# EAGLE design controller-board (EAGLE 7.3.0)
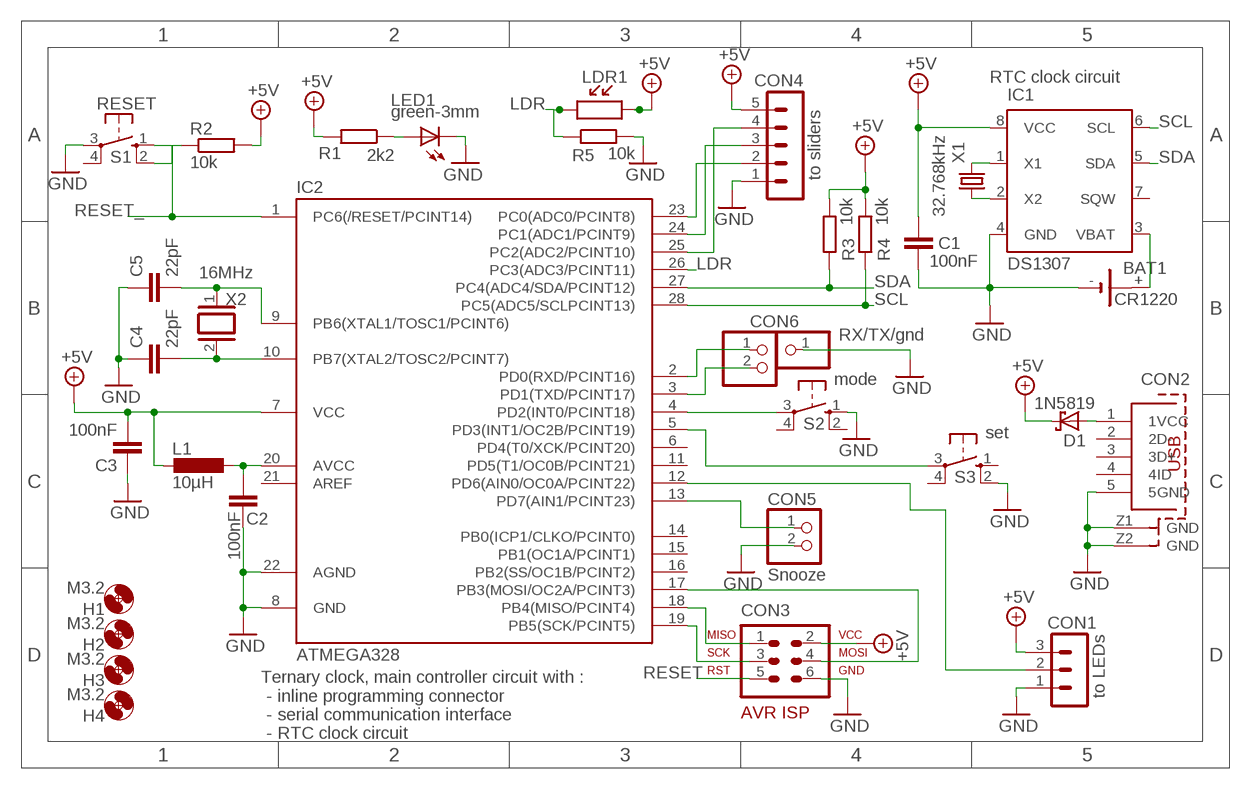
[diagram p0: schematic, sheet 1]

## Parts
BAT1  CR1220  CR1220HOLDER  [CR1220HOLDER]
C1  100nF  C-EU050-025X075  [C050-025X075]
C2  100nF  C-EU050-025X075  [C050-025X075]
C3  100nF  C-EU050-025X075  [C050-025X075]
C4  22pF  C2.5/2  [C2.5-2]
C5  22pF  C2.5/2  [C2.5-2]
CON1  to LEDs  MA03-1  [MA03-1]
CON2  614105150721  [614105150721]
CON3  AVR-ISP  AVR-ISP-6VERT  [AVR-ISP-6]
CON4  to sliders  MA05-1  [MA05-1]
CON5  Snooze  PINHD-1X2  [1X02]
CON6  RX/TX/gnd  PINHD-1X2  [1X02]
CON6B  Ser-GND  PINHD-1X1  [1X01]
D1  1N5819  1N5819-B  [DO41-7.6]
H1  M3.2  MOUNT-HOLE3.2  [3,2]
H2  M3.2  MOUNT-HOLE3.2  [3,2]
H3  M3.2  MOUNT-HOLE3.2  [3,2]
H4  M3.2  MOUNT-HOLE3.2  [3,2]
IC1  DS1307  [DIL08]
IC2  ATMEGA328  ATMEGA48/88/168-PU  [DIL28-3]
L1  10µH  L-EU0207/7  [0207/7]
LDR1  LDR  [LDR]
LED1  green-3mm  LED3MM  [LED3MM]
R1  2k2  R-EU_0207/7  [0207/7]
R2  10k  R-EU_0207/7  [0207/7]
R3  10k  R-EU_0207/7  [0207/7]
R4  10k  R-EU_0207/7  [0207/7]
R5  10k  R-EU_0207/7  [0207/7]
S1  RESET  10-XX  [B3F-10XX]
S2  mode  10-XX  [B3F-10XX]
S3  set  10-XX  [B3F-10XX]
X1  32.768kHz  CRYSTALTC38H  [TC38H]
X2  16MHz  XTAL/S  [QS]

## Nets
+5V: C1.1 C3.2 CON1.3 CON3.2 CON4.5 D1.C IC1.8(VCC) IC2.7(VCC) L1.2 LDR1.P$2 R1.2 R2.2 R3.2 R4.2
GND: BAT1.- C1.2 C2.1 C3.1 C4.1 C5.1 CON1.1 CON2.5(5GND) CON2.Z1(GND) CON2.Z2(GND) CON3.6 CON4.1 CON5.2 CON6B.1 IC1.4(GND) IC2.8(GND) IC2.22(AGND) LED1.K(C) R5.2 S1.3(P) S2.1(S) S3.2(S1)
LDR: IC2.26(PC3(ADC3/PCINT11)) LDR1.P$1 R5.1
N$2: C5.2 IC2.9(PB6(XTAL1/TOSC1/PCINT6)) X2.1
N$3: C2.2 IC2.20(AVCC) L1.1
N$4: IC2.4(PD2(INT0/PCINT18)) S2.3(P)
N$5: IC2.5(PD3(INT1/OC2B/PCINT19)) S3.3(P)
N$6: CON1.2 IC2.12(PD6(AIN0/OC0A/PCINT22))
N$7: C4.2 IC2.10(PB7(XTAL2/TOSC2/PCINT7)) X2.2
N$8: CON3.4 IC2.17(PB3(MOSI/OC2A/PCINT3))
N$9: CON3.1 IC2.18(PB4(MISO/PCINT4))
N$10: CON3.3 IC2.19(PB5(SCK/PCINT5))
N$11: CON6.2 IC2.3(PD1(TXD/PCINT17))
N$12: CON6.1 IC2.2(PD0(RXD/PCINT16))
N$16: CON4.4 IC2.25(PC2(ADC2/PCINT10))
N$17: CON4.3 IC2.24(PC1(ADC1/PCINT9))
N$19: CON4.2 IC2.23(PC0(ADC0/PCINT8))
N$20: IC1.1(X1) X1.2
N$21: IC1.2(X2) X1.1
N$22: BAT1.+ IC1.3(VBAT)
N$23: CON5.1 IC2.13(PD7(AIN1/PCINT23))
N$31: CON2.1(1VCC) D1.A
N$56: LED1.A R1.1
RESET: CON3.5 R2.1 S1.2(S1)
RESET_: IC2.1(PC6(/RESET/PCINT14)) S1.1(S)
SCL: IC1.6(SCL) IC2.28(PC5(ADC5/SCLPCINT13)) R4.1
SDA: IC1.5(SDA) IC2.27(PC4(ADC4/SDA/PCINT12)) R3.1
Unconnected: CON2.2(2D-) CON2.3(3D+) CON2.4(4ID) IC1.7(SQW) IC2.6(PD4(T0/XCK/PCINT20)) IC2.11(PD5(T1/OC0B/PCINT21)) IC2.14(PB0(ICP1/CLKO/PCINT0)) IC2.15(PB1(OC1A/PCINT1)) IC2.16(PB2(SS/OC1B/PCINT2)) IC2.21(AREF) S1.4(P1) S2.2(S1) S2.4(P1) S3.1(S) S3.4(P1)

## Notes on the sheet
- RTC clock circuit
- Ternary clock, main controller circuit with : 
   - inline programming connector
   - serial communication interface
   - RTC clock circuit

## Library data of the parts
BAT1 = base3clock:CR1220HOLDER: 3V lithium Battery Holder To be used with CR1220 batteries in horizontal position The included packages can be used for both surface and through-hole mounting (multifunctional pads)
C1 = rcl:C-EU: CAPACITOR, European symbol
C2 C3 = resistor:C-EU: CAPACITOR, European symbol
C4 C5 = capacitor-wima:C: CAPACITOR naming: grid - package width
CON1 = con-lstb:MA03-1: PIN HEADER; OC_FARNELL: unknown; OC_NEWARK: unknown
CON2 = Wurth_Elektronik_Electromechanic_Input-Output_Connectors_rev15c:614105150721: WR-COM_USB_Micro Type B_Vertical_THT; Micro Type B Vertical THT- Tape & Reel not for Pick & Place machine Code : Con_I-O_COM_USB_2.0_B_614105150721_614105150721 <http://katalog.we-online.de/media/images/eican/Con_I-O_COM_USB_2.0_B_614105150721_pf2.jpg> Details see: http://katalog.we-online.de/em/datasheet/614105150721.pdf Created 12/08/2014, Dan Xu 2014 (C) Wurth Elektronik
CON3 = avr-7:AVR-ISP-6: AVR ISP-6 Serial Programming Header
CON4 = con-lstb:MA05-1: PIN HEADER; OC_FARNELL: unknown; OC_NEWARK: unknown
CON5 CON6 = pinhead:PINHD-1X2: PIN HEADER
CON6B = pinhead:PINHD-1X1: PIN HEADER
D1 = diode:1N581*: 1.0A SCHOTTKY BARRIER RECTIFIER Source: http://www.diodes.com/datasheets/ds23001.pdf
H1-H4 = holes:MOUNT-HOLE: MOUNTING HOLE with drill center marker
IC1 = ds1307_pcf8583:DS1307: I2C-Bus CLOCK/CALENDAR
IC2 = atmega8:ATMEGA48/88/168-PU
L1 = resistor:L-EU: INDUCTOR, European symbol
LDR1 = base3clock:LDR: Generic LDR
LED1 = led:LED: LED OSRAM: - CHIPLED LG R971, LG N971, LY N971, LG Q971, LY Q971, LO R971, LY R971 LH N974, LH R974 LS Q976, LO Q976, LY Q976 LO Q996 - Hyper CHIPLED LW Q18S LB Q993, LB Q99A, LB R99A - SideLED LS A670, LO A670, LY A670, LG A670, LP A670 LB A673, LV A673, LT A673, LW A673 LH A674 LY A675 LS A676, LA A676, LO A676, LY A676, LW A676 LS A679, LY A679, LG A679 - Hyper Micro SIDELED® LS Y876, LA Y876, LO Y876, LY Y876 LT Y87S - SmartLED LW L88C, LW L88S LB L89C, LB L89S, LG L890 LS L89K, LO L89K, LY L89K LS L896, LA L896, LO L896, LY L896 - TOPLED LS T670, LO T670, LY T670, LG T670, LP T670 LSG T670, LSP T670, LSY T670, LOP T670, LYG T670 LG T671, LOG T671, LSG T671 LB T673, LV T673, LT T673, LW T673 LH T674 LS T676, LA T676, LO T676, LY T676, LB T676, LH T676, LSB T676, LW T676 LB T67C, LV T67C, LT T67C, LS T67K, LO T67K, LY T67K, LW E67C LS E67B, LA E67B, LO E67B, LY E67B, LB E67C, LV E67C, LT E67C LW T67C LS T679, LY T679, LG T679 LS T770, LO T770, LY T770, LG T770, LP T770 LB T773, LV T773, LT T773, LW T773 LH T774 LS E675, LA E675, LY E675, LS T675 LS T776, LA T776, LO T776, LY T776, LB T776 LHGB T686 LT T68C, LB T68C - Hyper Mini TOPLED® LB M676 - Mini TOPLED Santana® LG M470 LS M47K, LO M47K, LY M47K Source: http://www.osram.convergy.de LUXEON: - LUMILED® LXK2-PW12-R00, LXK2-PW12-S00, LXK2-PW14-U00, LXK2-PW14-V00 LXK2-PM12-R00, LXK2-PM12-S00, LXK2-PM14-U00 LXK2-PE12-Q00, LXK2-PE12-R00, LXK2-PE12-S00, LXK2-PE14-T00, LXK2-PE14-U00 LXK2-PB12-K00, LXK2-PB12-L00, LXK2-PB12-M00, LXK2-PB14-N00, LXK2-PB14-P00, LXK2-PB14-Q00 LXK2-PR12-L00, LXK2-PR12-M00, LXK2-PR14-Q00, LXK2-PR14-R00 LXK2-PD12-Q00, LXK2-PD12-R00, LXK2-PD12-S00 LXK2-PH12-R00, LXK2-PH12-S00 LXK2-PL12-P00, LXK2-PL12-Q00, LXK2-PL12-R00 Source: www.luxeon.com KINGBRIGHT: KA-3528ASYC Source: www.kingbright.com
R1 = rcl:R-EU_: RESISTOR, European symbol
R2-R5 = resistor:R-EU_: RESISTOR, European symbol
S1-S3 = switch-omron:10-XX: OMRON SWITCH; MPN: B3F-1000; OC_FARNELL: 176432; OC_NEWARK: 36M3542
X1 = adafruit:CRYSTAL: CRYSTAL; OC_FARNELL: unknown; OC_NEWARK: unknown
X2 = special:XTAL/S: CRYSTAL

## Board
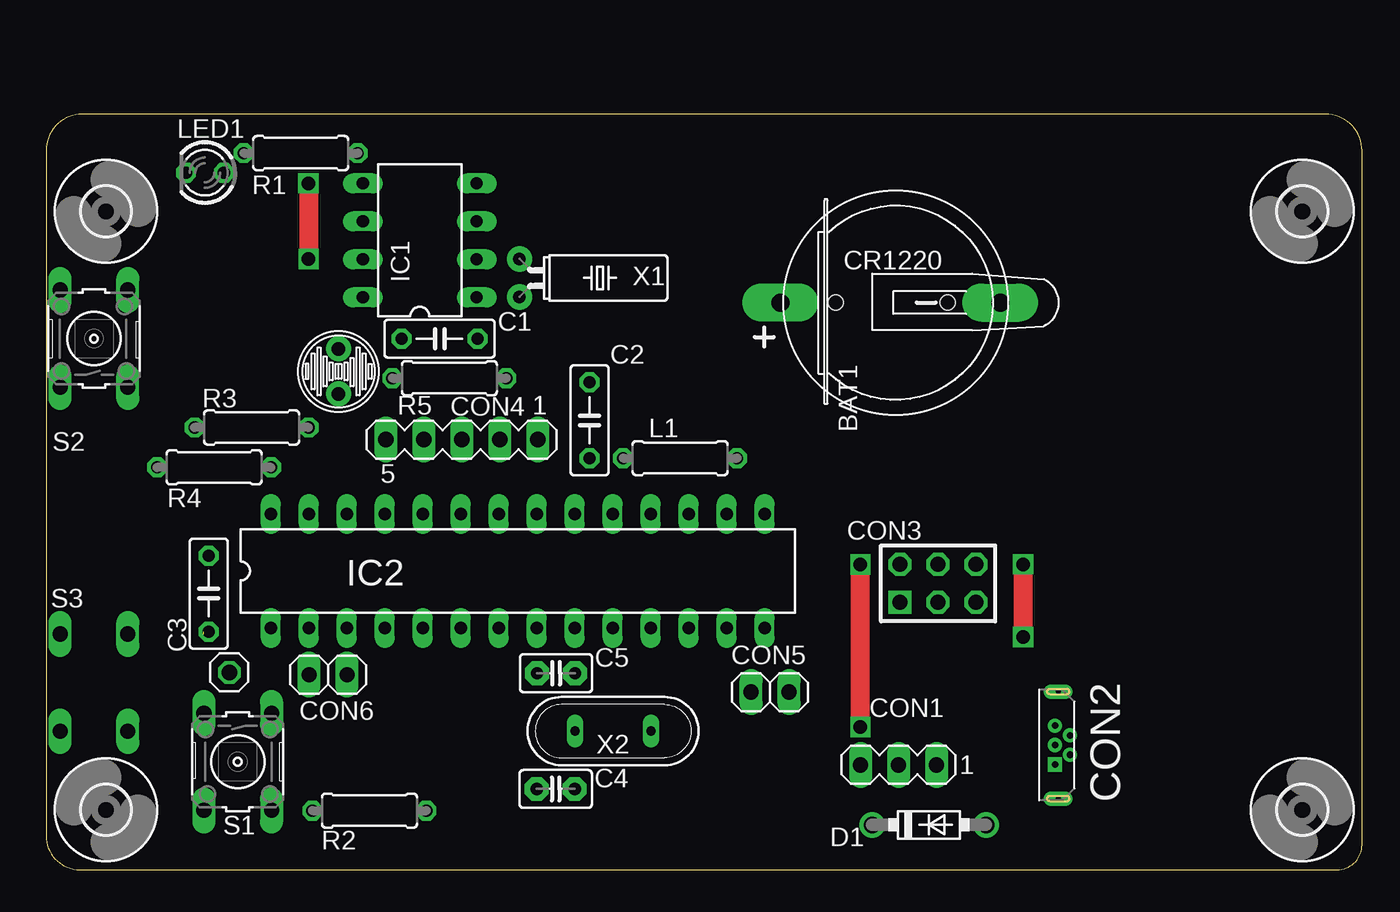
[diagram p1: board, top side]
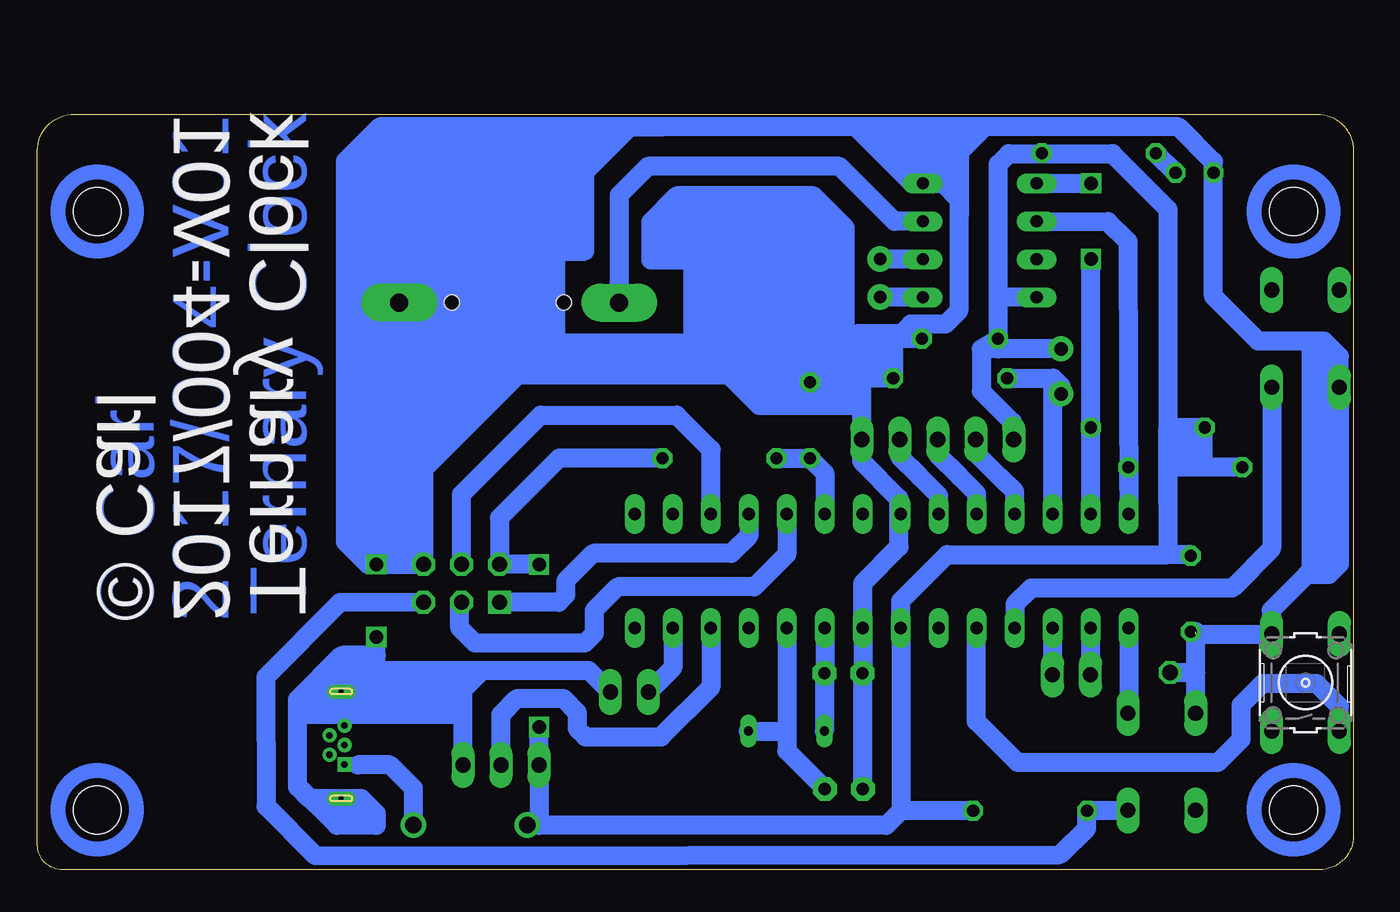
[diagram p2: board, bottom side, seen from below]

Size 88 x 50.5 mm. Coordinates in mm from the lower left corner, seen from the top.
Outline: 85.56,50.5 2.42,50.5 arc90 0,48.08 0,2.26 arc90 2.26,0 86.33,0 arc90 88,1.67 88,48.05 arc90 85.56,50.5
Copper layers (1*16): Top 0.035mm / dielectric 1.5mm / Bottom 0.035mm
Design rules "default": minimum track width 10mil, minimum drill 24mil, track to track 8mil, track to pad 8mil, pad to pad 8mil, via to via 8mil, smd to smd 8mil, copper to edge 40mil, drill to drill 8mil, minimum pad ring 10mil, minimum via ring 8mil, stop-mask expansion 4mil, vias tented up to drill 0mil, thermal gap 10mil

### Footprints (pad centres in the part's own frame; a part is rotated, then mirrored left to right if it is on the bottom)
CR1220HOLDER = drill 1.2 pad 2.54 long: + 7.7,0; - -7,0 | hole 1: -3.5,0; 4,0
C050-025X075 = drill 0.813 octagon: 1 -2.54,0; 2 2.54,0
C2.5-2 = drill 0.813 pad 1.6 octagon: 1 -1.27,0; 2 1.27,0
MA03-1 = drill 1.016 long: 1 -2.54,0; 2 0,0; 3 2.54,0
614105150721 = drill 0.44 pad 0.94 square: 1 2.275,0.22 | drill 0.44 pad 0.94: 2 2.925,-0.78; 3 3.575,0.22; 4 4.225,-0.78; 5 4.875,0.22 | drill 0.35 pad 0.97 long: Z1 0,0; Z2 7.15,0
AVR-ISP-6 = drill 1.016 square: 1 -2.54,-1.27 | drill 1.016 octagon: 2 -2.54,1.27; 3 0,-1.27; 4 0,1.27; 5 2.54,-1.27; 6 2.54,1.27
MA05-1 = drill 1.016 long: 1 -5.08,0; 2 -2.54,0; 3 0,0; 4 2.54,0; 5 5.08,0
1X02 = drill 1.016 long: 1 -1.27,0; 2 1.27,0
1X01 = drill 1.016 octagon: 1 0,0
DO41-7.6 = drill 1.1 pad 1.7: A 3.81,0; C -3.81,0
3,2 = hole 3.2: 0,0
DIL08 = drill 0.813 long: 1 -3.81,-3.81; 2 -1.27,-3.81; 3 1.27,-3.81; 4 3.81,-3.81; 5 3.81,3.81; 6 1.27,3.81; 7 -1.27,3.81; 8 -3.81,3.81
DIL28-3 = drill 0.813 long: 1 -16.51,-3.81; 2 -13.97,-3.81; 3 -11.43,-3.81; 4 -8.89,-3.81; 5 -6.35,-3.81; 6 -3.81,-3.81; 7 -1.27,-3.81; 8 1.27,-3.81; 9 3.81,-3.81; 10 6.35,-3.81; 11 8.89,-3.81; 12 11.43,-3.81; 13 13.97,-3.81; 14 16.51,-3.81; 15 16.51,3.81; 16 13.97,3.81; 17 11.43,3.81; 18 8.89,3.81; 19 6.35,3.81; 20 3.81,3.81; 21 1.27,3.81; 22 -1.27,3.81; 23 -3.81,3.81; 24 -6.35,3.81; 25 -8.89,3.81; 26 -11.43,3.81; 27 -13.97,3.81; 28 -16.51,3.81
0207/7 = drill 0.813 octagon: 1 -3.81,0; 2 3.81,0
LDR = drill 0.9 pad 1.676: P$1 -1.5,0; P$2 1.5,0
LED3MM = drill 0.813 octagon: A -1.27,0; K 1.27,0
B3F-10XX = drill 1.016 long: 1 -3.251,2.261; 2 3.251,2.261; 3 -3.251,-2.261; 4 3.251,-2.261
TC38H = drill 0.813 pad 1.676: 1 -1.27,0; 2 1.27,0
QS = drill 0.61 long: 1 -2.54,0; 2 2.54,0

### Placement (x,y rotation side)
BAT1  56.8,37.9 180 top
C1  26.31,35.5 0 top
C2  36.34,30.04 270 top
C3  10.87,18.45 90 top
C4  34.08,5.39 0 top
C5  34.1,13.13 0 top
CON1  57,7 180 top
CON2  67.68,4.75 90 top
CON3  59.64,19.14 0 top
CON4  27.8,28.75 180 top
CON5  48.41,11.87 0 top
CON6  18.85,13.04 0 top
CON6B  12.25,13.19 0 top
D1  59.04,3 0 top
H1  84,44 0 top
H2  84,4 180 top
H3  4,4 90 top
H4  4,44 0 top
IC1  24.99,42.07 90 top
IC2  31.54,19.97 0 top
L1  42.39,27.51 0 top
LDR1  19.55,33.31 90 top
LED1  10.61,46.59 180 top
R1  17.03,47.9 0 top
R2  21.62,3.94 0 top
R3  13.74,29.56 180 top
R4  11.23,26.9 180 top
R5  26.97,32.85 0 top
S1  12.81,7.21 270 top
S2  3.2,35.5 90 top
S3  3.2,12.5 90 bottom
X1  31.65,39.55 270 top
X2  37.91,9.27 0 top

### Tracks (layer width: path | path; a pad name or v marks a point on that pad's centre or on a via)
+5V  (via drill 0.9)
  Top 1.27: v54.45,9.54 v54.45,20.4
  Bottom 1.27: IC1.8 23.74,38.27 | 12.4,21.06 27.18,21.06 30.27,17.97 IC2.7 30.27,3.93 | 12.4,24.42 12.4,29.55 | 12.4,24.42 12.4,21.06 | C3.2 10.87,21.06 12.4,21.06 | R4.2 12.4,26.9 12.4,24.42 | R3.2 12.4,29.55 | L1.2 53.1,27.51 57.1,23.51 CON3.2 v54.45,20.4 | 23.73,34.81 23.75,35.59 | 23.75,35.59 23.74,37.9 | 23.74,37.9 23.74,38.27 | 23.74,38.27 23.7,38.26 | 23.74,37.9 23.74,47.16 23.05,47.86 20.82,47.86 | 20.82,47.86 16.11,47.86 12.39,44.13 12.39,29.55 12.4,29.55 | 22.72,29.39 CON4.5 22.8,28.83 22.8,29.91 24.88,31.99 24.88,34.81 | 24.88,34.81 C1.1 23.75,35.5 23.75,35.59 | LDR1.P$2 24.88,34.81 | 30.27,3.93 31.23,2.97 54.46,2.97 | R2.2 25.43,3.93 30.27,3.93 | R1.2 20.82,47.9 20.82,47.86 | 54.46,2.97 CON1.3 v54.45,9.54 | 54.46,2.97 55.23,2.97 D1.C
GND  (via drill 0.9)  (1 unrouted)
  Top 1.27: v65.34,15.55 v65.34,20.41 v65.33,20.41
  Bottom 0.813: CON2.5 67.46,11.9 CON2.Z2
  Bottom 1.27: 10.53,15.75 S3.2 5.5,15.75 5.5,17.33 3.12,19.72 1.64,19.72 0.94,20.42 S2.1 0.94,34.32 1.96,35.34 6.37,35.34 9.36,38.32 9.36,46.59 | 30.37,23.78 30.37,21.58 32.81,19.14 IC2.8 32.81,13.15 C5.1 32.83,5.41 C4.1 | 30.37,23.78 IC2.22 | CON3.6 v65.33,20.41 v65.33,20.4 65.91,20.4 67.41,21.9 67.41,37.9 | S1.3 10.55,13.17 10.55,13.19 | 10.55,13.19 10.55,15.91 C3.1 | CON2.Z1 69.82,4.75 70.6,5.53 70.6,11.16 69.84,11.92 67.68,11.92 CON2.Z2 65.34,11.9 | 65.34,11.9 v65.34,15.55 | 59.67,11.9 65.34,11.9 | 30.37,23.78 30.37,24.8 32.88,27.31 CON4.1 32.88,32.87 | 32.88,32.87 32.88,35.56 | 32.88,35.56 32.88,35.7 | C2.1 32.86,32.58 32.86,32.85 | IC1.4 28.79,45.88 | 28.79,45.88 27.45,45.88 26.36,44.79 26.39,37.35 27.27,36.47 29.6,36.47 30.13,35.93 31.16,35.5 | 28.79,45.88 28.79,49.66 | C1.2 31.16,35.5 | 9.36,46.59 9.36,47.34 11.68,49.66 28.79,49.66 | CON5.2 51.11,13.31 58.27,13.31 59.67,11.9 | 28.79,49.66 65.11,49.66 67.41,47.36 67.41,37.9 | R5.2 32.86,32.85 | 32.86,32.85 32.88,32.87 | 31.16,35.5 32.86,35.58 32.88,35.56 | LED1.K 9.36,46.59 | CON1.1 59.54,11.9 59.67,11.9 | BAT1.- 67.41,37.9 | CON6B.1 10.55,13.19
LDR
  Bottom 1.27: R5.1 20.07,32.85 19.55,32.34 | 19.55,32.34 LDR1.P$1 | IC2.26 20.11,32.34 19.55,32.34
N$2
  Bottom 1.27: IC2.9 35.35,13.15 C5.2 X2.1
N$3
  Bottom 1.27: L1.1 C2.2 35.35,26.51 IC2.20
N$4
  Bottom 1.27: S2.3 5.46,21.47 8.11,18.82 21.55,18.82 22.62,17.75 22.62,16.16 IC2.4
N$5
  Bottom 1.27: S3.3 0.94,10.92 2.45,12.43 6.09,12.43 7.53,10.99 7.53,8.69 9.07,7.15 22.45,7.15 25.21,9.92 25.21,16.16 IC2.5
N$6
  Bottom 1.27: IC2.12 42.97,12.19 46.28,8.87 51.35,8.87 51.9,9.42 51.9,10.49 52.85,11.45 55.91,11.45 57,10.36 CON1.2
N$7
  Bottom 1.27: IC2.10 37.89,9.26 | 37.89,9.26 37.89,7.93 C4.2 | X2.2 37.9,9.27 37.89,9.26
N$8
  Bottom 1.27: IC2.17 42.95,28.08 45.26,30.39 54.34,30.39 59.64,25.09 CON3.4
N$9
  Bottom 1.27: IC2.18 40.43,22.3 41.59,21.14 50.83,21.14 52.67,19.3 52.67,18.34 53.14,17.87 CON3.1
N$10
  Bottom 1.27: IC2.19 37.89,21.08 40.06,18.9 49.2,18.9 50.76,17.34 50.76,15.78 51.41,15.13 58.74,15.13 59.76,16.16 59.76,17.87 CON3.3
N$11
  Bottom 1.27: IC2.3 CON6.2
N$12
  Bottom 1.27: IC2.2 CON6.1
N$13
  Bottom 1.27: 33.24,30.98 33.24,31.03 39.74,31.03 41.77,33.06 53.31,33.06 53.31,47.11 51.03,49.4 51.03,49.41
N$14
  Bottom 1.27: 30.38,35.82 33.24,35.82
N$15
  Bottom 1.27: 52.81,33.35 52.83,33.35 53.13,33.05 55.88,33.05 62.17,26.75 62.17,20.37
N$16
  Bottom 1.27: IC2.25 22.65,25.26 23.62,26.24 25.27,27.88 CON4.4
N$17
  Bottom 1.27: IC2.24 25.19,25.12 26.32,26.26 27.8,27.74 CON4.3
N$19
  Bottom 1.27: IC2.23 27.73,24.99 29,26.26 30.34,27.6 CON4.2
N$20
  Bottom 1.27: IC1.1 31.64,38.26 X1.2
N$21
  Bottom 1.27: IC1.2 31.64,40.8 X1.1
N$22
  Bottom 1.27: IC1.3 30.68,43.34 34.35,47.01 47.17,47.01 49.1,45.09 BAT1.+
N$23
  Bottom 1.27: IC2.13 45.51,13.5 CON5.1
N$24
  Bottom 1.27: 65.35,14.32 67.58,14.32 69.46,12.45 69.46,12.08 68.72,12.08 68.72,13.17 66.1,13.17 66.1,13.11
N$25
  Bottom 1.27: 67.74,4.68 67.84,4.68 67.84,4.76 66.34,4.76 65.35,3.77 65.35,2.96 67.96,2.96 70.59,5.59 70.6,11.36 67.65,14.32 65.49,14.32 65.47,14.2
N$26
  Bottom 1.27: 65.81,3.96 67.91,3.96 67.91,3.88
N$27
  Bottom 1.27: 33.62,31.45 33.97,31.45 33.97,42.9 36.1,45.03 45.25,45.03 46.99,43.29 46.99,40.75 44.2,40.75 44.2,35.2 53.53,35.2 53.53,35.15
N$28
  Bottom 1.27: 55.2,41.35 51.39,41.35 51.39,46.64 48.37,49.66 46.09,49.66
N$29
  Bottom 1.27: 49.99,49.16 52.29,46.87 52.29,42.23
N$30
  Bottom 1.27: 51.96,33.16 53.57,34.77
N$31
  Bottom 0.813: 66.57,7.01 66.57,7.03 CON2.1
  Bottom 1.27: D1.A 62.85,5.44 64.41,7.01 66.57,7.01
N$33
  Bottom 1.27: 28.74,45.84 29.48,45.84 33.25,49.61
N$34
  Bottom 1.27: 28.95,49.26 26.35,49.26 26.35,43.67
N$35
  Bottom 1.27: 26.87,47.25 26.87,47.43 24.67,49.63
N$56
  Bottom 1.27: R1.1 13.19,47.9 LED1.A
RESET
  Bottom 1.27: S1.2 15.07,3.94 R2.1 17.84,2.76 19.64,1 69.41,0.94 72.71,4.23 72.73,12.86 67.78,17.85 CON3.5
RESET_
  Bottom 1.27: IC2.1 15.03,10.46 S1.1
SCL
  Bottom 1.27: IC1.6 16.4,43.32 15.07,41.99 IC2.28 R4.1
SDA  (via drill 0.9)
  Top 1.27: v17.54,45.88 v17.55,40.81
  Bottom 1.27: IC1.5 17.52,45.88 v17.54,45.88 | IC2.27 R3.1 v17.55,40.81
(copper drawn outside any net)
  shapes: Bottom area x23, Bottom circle x4

### Text on the board
Bottom: 2017/004-V01 | © Carl | Ternary Clock
bNames: 2017/004-V01 | © Carl | Ternary Clock
tValues: +5V | data | GND